# Altium schematic sheet 01_Block Diagram.SchDoc
size A2
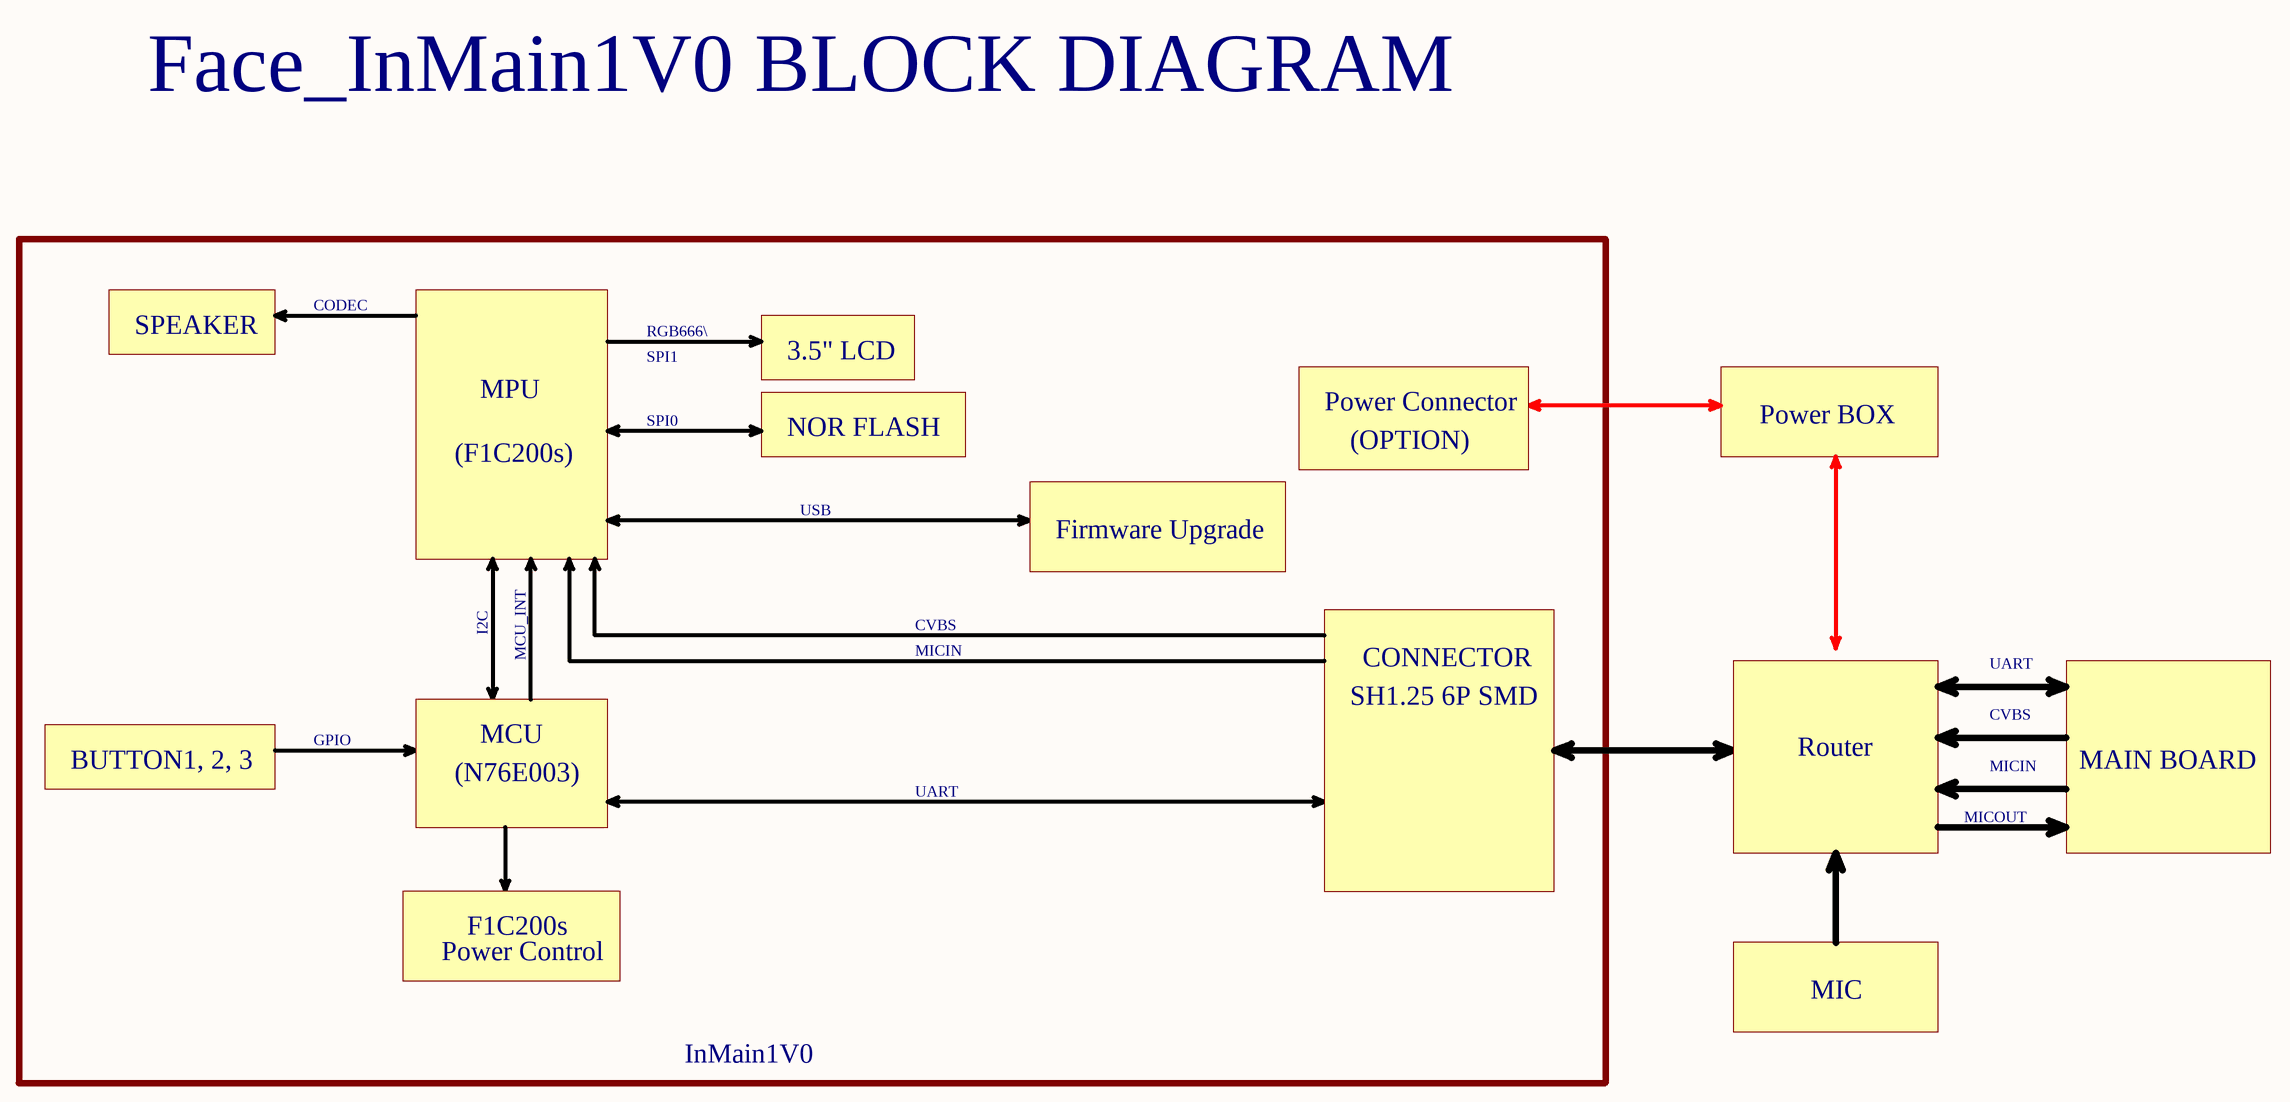
[diagram p0: 01_Block Diagram.SchDoc]

## Notes on the sheet
- Face_InMain1V0 BLOCK DIAGRAM
- SPEAKER
- CODEC
- RGB666\
- MPU
- SPI1
- 3.5" LCD
- (F1C200s)
- SPI0
- NOR FLASH
- Power Connector
- (OPTION)
- Power BOX
- USB
- Firmware Upgrade
- I2C
- MCU_INT
- CVBS
- MICIN
- SH1.25 6P SMD
- CONNECTOR
- UART
- BUTTON1, 2, 3
- GPIO
- (N76E003)
- MCU
- Router
- MAIN BOARD
- MICOUT
- Power Control
- F1C200s
- MIC
- InMain1V0
- Title
- Size:
- Date:
- File:
- A2
- Number:
- Time:
- Revision:
- Sheet
- of